# EAGLE design LaserGRBL_v2 (EAGLE 7.4.0)
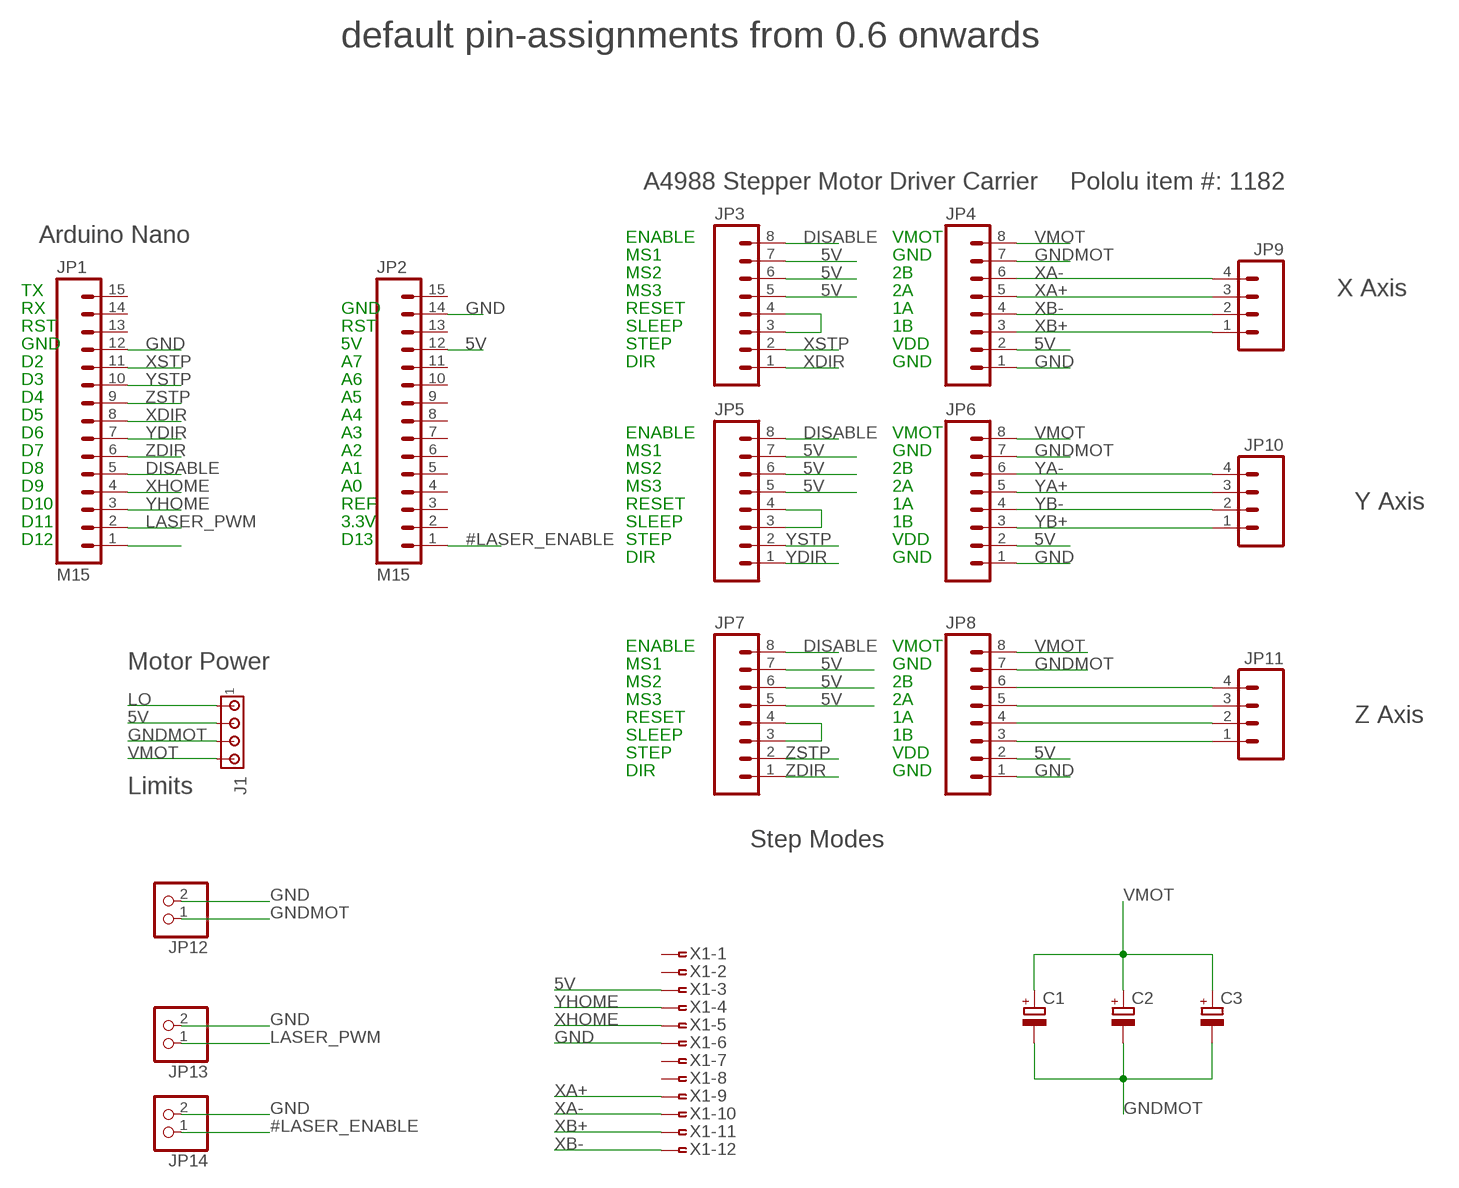
[diagram p0: schematic, sheet 1]

## Parts
C1  CPOL-EUE5-10.5  [E5-10,5]
C2  CPOL-EUE5-10.5  [E5-10,5]
C3  CPOL-EUE5-10.5  [E5-10,5]
J1  MTA04-156  [1X4MTA]
JP1  M15  [1X15]
JP2  M15  [1X15]
JP3  M08LONGPADS  [1X08_LONGPADS]
JP4  M08LONGPADS  [1X08_LONGPADS]
JP5  M08LONGPADS  [1X08_LONGPADS]
JP6  M08LONGPADS  [1X08_LONGPADS]
JP7  M08LONGPADS  [1X08_LONGPADS]
JP8  M08LONGPADS  [1X08_LONGPADS]
JP9  M04LONGPADS  [1X04_LONGPADS]
JP10  M04LONGPADS  [1X04_LONGPADS]
JP11  M04LONGPADS  [1X04_LONGPADS]
JP12  PINHD-1X2  [1X02]
JP13  PINHD-1X2  [1X02]
JP14  PINHD-1X2  [1X02]
X1  FSIDE-12  [FSIDE-12]

## Nets
5V: J1.2 JP2.12 JP3.5 JP3.6 JP3.7 JP4.2 JP5.5 JP5.6 JP5.7 JP6.2 JP7.5 JP7.6 JP7.7 JP8.2 X1.3
#LASER_ENABLE: JP2.1 JP14.1
DISABLE: JP1.5 JP3.8 JP5.8 JP7.8
GND: JP1.12 JP2.14 JP4.1 JP6.1 JP8.1 JP12.2 JP13.2 JP14.2 X1.6
GNDMOT: C1.- C2.- C3.- J1.3 JP4.7 JP6.7 JP8.7 JP12.1
LASER_PWM: JP1.2 JP13.1
LO: J1.1
N$1: JP5.3 JP5.4
N$6: JP8.6 JP11.4
N$7: JP8.5 JP11.3
N$8: JP8.4 JP11.2
N$9: JP8.3 JP11.1
N$14: JP7.3 JP7.4
N$15: JP3.3 JP3.4
N$16: JP1.1
VMOT: C1.+ C2.+ C3.+ J1.4 JP4.8 JP6.8 JP8.8
XA+: JP4.5 JP9.3 X1.9
XA-: JP4.6 JP9.4 X1.10
XB+: JP4.3 JP9.1 X1.11
XB-: JP4.4 JP9.2 X1.12
XDIR: JP1.8 JP3.1
XHOME: JP1.4 X1.5
XSTP: JP1.11 JP3.2
YA+: JP6.5 JP10.3
YA-: JP6.6 JP10.4
YB+: JP6.3 JP10.1
YB-: JP6.4 JP10.2
YDIR: JP1.7 JP5.1
YHOME: JP1.3 X1.4
YSTP: JP1.10 JP5.2
ZDIR: JP1.6 JP7.1
ZSTP: JP1.9 JP7.2
Unconnected: JP1.13 JP1.14 JP1.15 JP2.2 JP2.3 JP2.4 JP2.5 JP2.6 JP2.7 JP2.8 JP2.9 JP2.10 JP2.11 JP2.13 JP2.15 X1.1 X1.2 X1.7 X1.8

## Notes on the sheet
- default pin-assignments from 0.6 onwards
- A4988 Stepper Motor Driver Carrier | Pololu item #: 1182
- Arduino Nano | ENABLE | VMOT
- MS1 | GND
- MS2 | 2B
- TX | MS3 | 2A | X Axis
- RX | GND | RESET | 1A
- RST | RST | SLEEP | 1B
- GND | 5V | STEP | VDD
- D2 | A7 | DIR | GND
- D3 | A6
- D4 | A5
- D5 | A4
- D6 | A3 | ENABLE | VMOT
- D7 | A2 | MS1 | GND
- D8 | A1 | MS2 | 2B
- D9 | A0 | MS3 | 2A
- D10 | REF | RESET | 1A | Y Axis
- D11 | 3.3V | SLEEP | 1B
- D12 | D13 | STEP | VDD
- DIR | GND
- ENABLE | VMOT
- Motor Power | MS1 | GND
- MS2 | 2B
- MS3 | 2A
- RESET | 1A | Z Axis
- SLEEP | 1B
- STEP | VDD
- DIR | GND
- Limits
- Step Modes

## Library data of the parts
C1-C3 = rcl:CPOL-EU: POLARIZED CAPACITOR, European symbol
J1 = con-amp:MTA04-156: AMP connector
JP1 JP2 = SparkFun:M15: Header 15 Standard 15-pin 0.1" header. Use with straight break away headers (SKU : PRT-00116), right angle break away headers (PRT-00553), swiss pins (PRT-00743), machine pins (PRT-00117), and female headers (PRT-00115).
JP3-JP8 = SparkFun:M08: Header 8 Standard 8-pin 0.1" header. Use with straight break away headers (SKU : PRT-00116), right angle break away headers (PRT-00553), swiss pins (PRT-00743), machine pins (PRT-00117), and female headers (PRT-00115).
JP9-JP11 = SparkFun:M04: Header 4 Standard 4-pin 0.1" header. Use with straight break away headers (SKU : PRT-00116), right angle break away headers (PRT-00553), swiss pins (PRT-00743), machine pins (PRT-00117), and female headers (PRT-00115). Molex polarized connector foot print use with SKU : PRT-08231 with associated crimp pins and housings. 1MM SMD Version SKU: PRT-10208
JP12-JP14 = pinhead:PINHD-1X2: PIN HEADER
X1 = con-amp:FSIDE-12: AMP connector

## Board
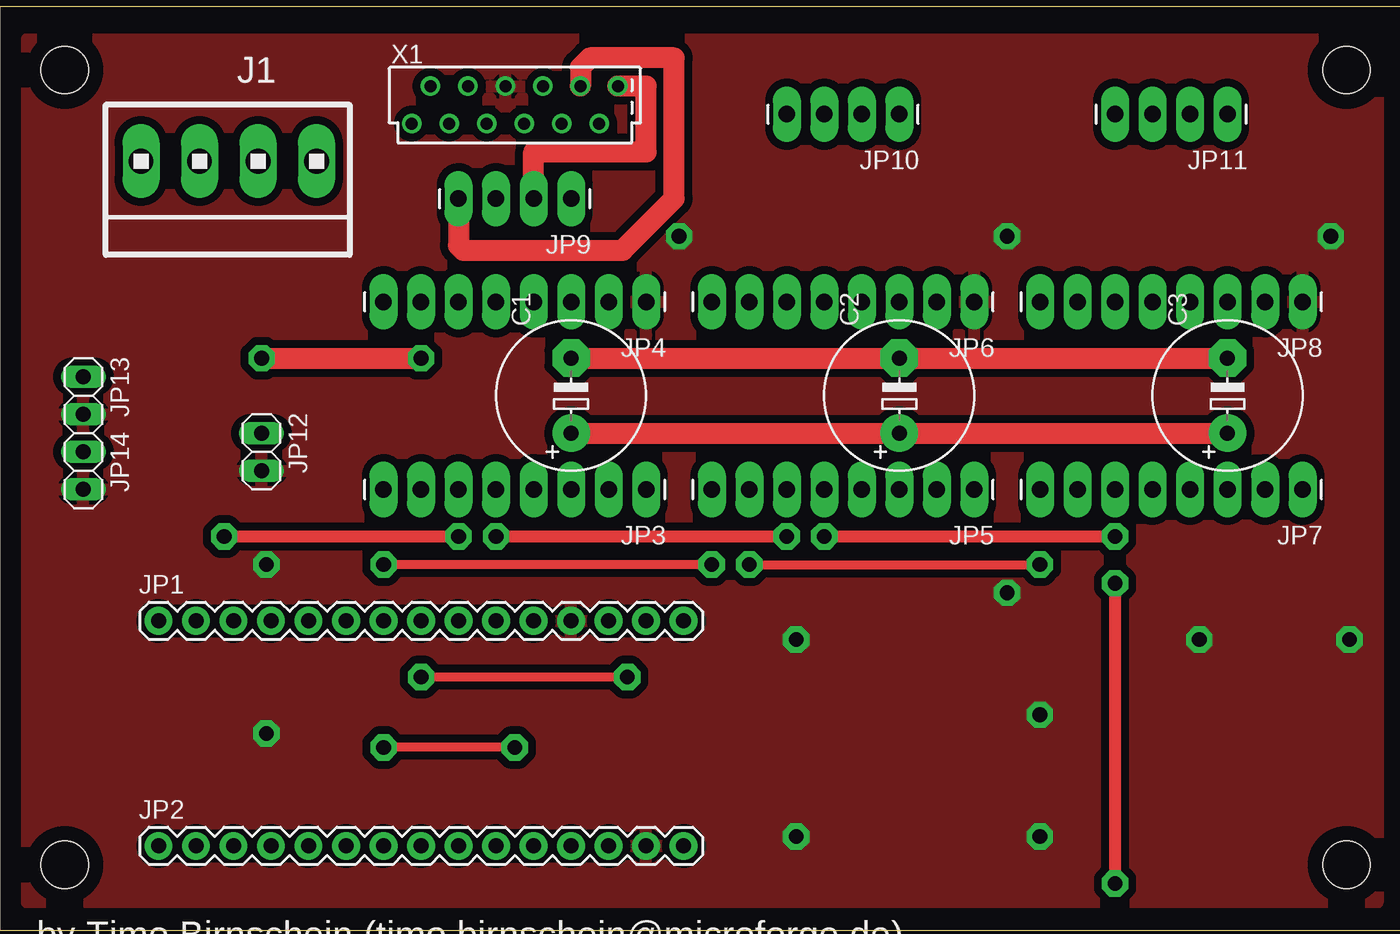
[diagram p1: board, top side]
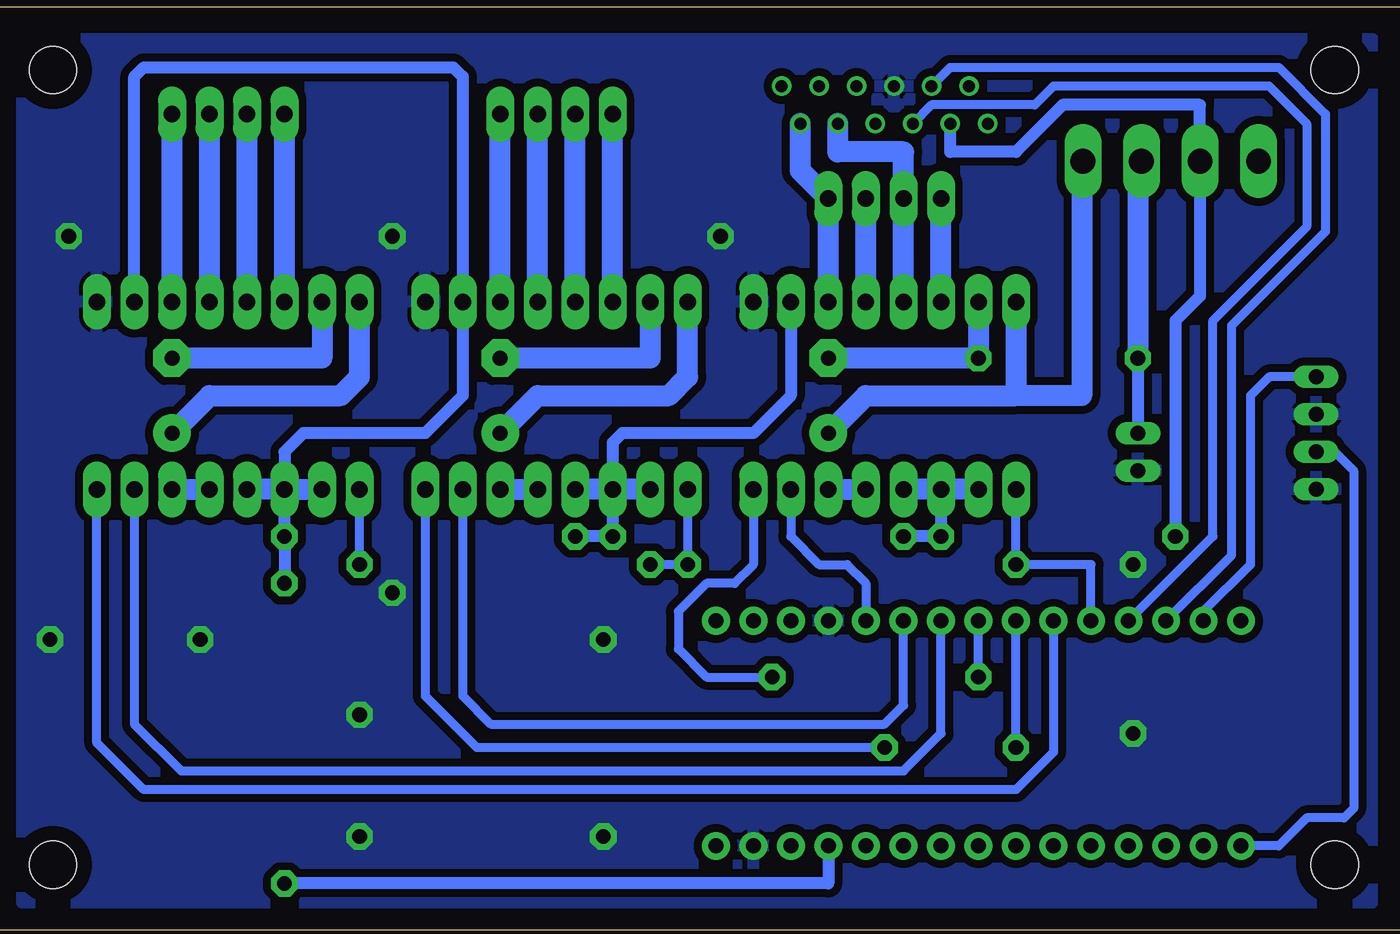
[diagram p2: board, bottom side, seen from below]

No outline drawn. Coordinates in mm, seen from the top.
Copper layers (1*16): Top 0.035mm / dielectric 1.5mm / Bottom 0.035mm
Design rules "default": minimum track width 25mil, minimum drill 28mil, track to track 10mil, track to pad 10mil, pad to pad 10mil, via to via 10mil, smd to smd 10mil, copper to edge 40mil, drill to drill 8mil, minimum pad ring 10mil, minimum via ring 8mil, stop-mask expansion 4mil, vias tented up to drill 0mil, thermal gap 10mil
Holes 3.2 mm at 2.54,56.34 89.34,56.34 89.34,2.54 2.54,2.54
Milling: 4 lines

### Footprints (pad centres in the part's own frame; a part is rotated, then mirrored left to right if it is on the bottom)
E5-10,5 = drill 1.016 pad 2.54: + -2.54,0 | drill 1.016 pad 2.54 octagon: - 2.54,0
1X4MTA = drill 1.676 long: 1 5.944,0; 2 1.981,0; 3 -1.981,0; 4 -5.944,0
1X15 = drill 1.016 pad 1.88: 1 0,0; 2 2.54,0; 3 5.08,0; 4 7.62,0; 5 10.16,0; 6 12.7,0; 7 15.24,0; 8 17.78,0; 9 20.32,0; 10 22.86,0; 11 25.4,0; 12 27.94,0; 13 30.48,0; 14 33.02,0; 15 35.56,0
1X08_LONGPADS = drill 1.118 pad 1.88 long: 1 0,0; 2 2.54,0; 3 5.08,0; 4 7.62,0; 5 10.16,0; 6 12.7,0; 7 15.24,0; 8 17.78,0
1X04_LONGPADS = drill 1.118 pad 1.88 long: 1 0,0; 2 2.54,0; 3 5.08,0; 4 7.62,0
1X02 = drill 1.016 long: 1 -1.27,0; 2 1.27,0
FSIDE-12 = drill 0.813: 1 -6.985,-1.27; 2 -5.715,1.27; 3 -4.445,-1.27; 4 -3.175,1.27; 5 -1.905,-1.27; 6 -0.635,1.27; 7 0.635,-1.27; 8 1.905,1.27; 9 3.175,-1.27; 10 4.445,1.27; 11 5.715,-1.27; 12 6.985,1.27

### Placement (x,y rotation side)
C1  36.83,34.29 90 top
C2  59.05,34.29 90 top
C3  81.28,34.29 90 top
J1  13.65,50.16 180 top
JP1  8.89,19.05 0 top
JP2  8.89,3.81 0 top
JP3  41.91,27.94 180 top
JP4  41.91,40.64 180 top
JP5  64.14,27.94 180 top
JP6  64.14,40.64 180 top
JP7  86.36,27.94 180 top
JP8  86.36,40.64 180 top
JP9  36.83,47.62 180 top
JP10  59.05,53.34 180 top
JP11  81.28,53.34 180 top
JP12  15.88,30.48 270 top
JP13  3.81,34.29 270 top
JP14  3.81,29.21 270 top
X1  33.02,53.98 0 top

### Tracks (layer width: path | path; a pad name or v marks a point on that pad's centre or on a via)
5V  (via drill 1 pad 1.78)
  Top 0.813: v13.34,24.77 v29.21,24.77 | v73.66,21.59 v73.66,1.27 | v53.98,24.77 v73.66,24.77 | v31.75,24.77 v51.44,24.77
  Bottom 0.813: X1.3 28.57,50.8 24.13,50.8 20.95,53.98 11.67,53.98 J1.2 11.67,41.03 13.34,39.37 v13.34,24.77 | JP3.6 v29.21,24.77 v31.75,24.77 | JP4.2 39.37,34.29 41.91,31.75 50.8,31.75 51.44,31.11 JP5.6 v51.44,24.77 v53.98,24.77 | JP8.2 83.82,55.88 83.19,56.52 62.23,56.52 61.59,55.88 JP6.2 61.59,34.29 64.14,31.75 72.39,31.75 73.66,30.48 JP7.6 v73.66,24.77 v73.66,21.59 | JP2.12 36.83,1.27 v73.66,1.27
  Bottom 1.422: JP3.7 JP3.6 JP3.5 | JP5.7 JP5.6 JP5.5 | JP7.7 JP7.6 JP7.5
#LASER_ENABLE
  Bottom 0.406: JP14.1 2.54,30.48
  Bottom 0.61: 2.54,30.48 1.27,29.21 1.27,6.35 1.91,5.71 4.45,5.71 6.35,3.81 JP2.1
DISABLE  (via drill 1 pad 1.78)
  Top 0.61: v46.35,22.86 v24.13,22.86 | v48.9,22.86 v68.58,22.86
  Bottom 0.61: JP1.5 19.05,22.86 v24.13,22.86 JP3.8 | JP5.8 v46.35,22.86 v48.9,22.86 | v68.58,22.86 JP7.8
GND  (via drill 1 pad 1.78)
  other vias: 66.36,45.09 66.36,20.95 68.58,12.7 68.58,4.45 79.38,17.78 89.53,17.78 88.27,45.09 52.07,17.78 52.07,4.45 44.13,45.09 16.19,11.43 16.19,22.86
  pour Bottom (isolate 0.533, rank 6): 0,58.42 91.44,58.42 91.44,0 0,0
  pour Top (isolate 0.533, rank 6): 0,58.42 91.44,58.42 91.44,0 0,0
GNDMOT  (via drill 1 pad 1.78)
  Top 1.422: v15.88,36.83 v26.67,36.83 | C1.- C2.- C3.-
  Bottom 0.813: v15.88,36.83 JP12.1
  Bottom 1.422: JP4.7 v26.67,36.83 C1.- | JP6.7 48.9,36.83 C2.- | JP8.7 71.12,36.83 C3.- | J1.3 15.88,49.92 v15.88,36.83
LASER_PWM
  Bottom 0.61: JP13.1 6.99,35.56 8.26,34.29 8.26,22.86 11.43,19.68 JP1.2
N$1
  Bottom 1.422: JP5.3 JP5.4
N$6
  Bottom 1.422: JP8.6 JP11.4
N$7
  Bottom 1.422: JP8.5 JP11.3
N$8
  Bottom 1.422: JP8.4 JP11.2
N$9
  Bottom 1.422: JP8.3 JP11.1
N$14
  Bottom 1.422: JP7.3 JP7.4
N$15
  Bottom 1.422: JP3.3 JP3.4
VMOT
  Top 1.422: C1.+ C2.+ C3.+
  Bottom 1.422: JP4.8 24.13,34.29 | J1.4 19.68,50.08 19.68,34.29 24.13,34.29 | C1.+ 34.29,34.29 24.13,34.29 | C3.+ 78.74,34.29 69.85,34.29 68.58,35.56 JP8.8 | C2.+ 56.52,34.29 47.62,34.29 46.35,35.56 JP6.8
XA+
  Bottom 1.422: JP4.5 JP9.3 31.75,50.8 36.2,50.8 X1.9
XA-
  Top 1.422: JP9.4 29.21,44.45 29.53,44.13 40.32,44.13 43.81,47.62 43.81,57.15 38.1,57.15 37.47,56.52 X1.10
  Bottom 1.422: JP4.6 JP9.4
XB+
  Bottom 1.422: JP4.3 JP9.1 38.73,49.53 X1.11
XB-
  Top 1.422: JP9.2 34.29,50.8 41.91,50.8 41.91,55.24 X1.12
  Bottom 1.422: JP4.4 JP9.2
XDIR  (via drill 1 pad 1.78)
  Top 0.61: v40.64,15.24 v26.67,15.24
  Bottom 0.61: JP3.1 41.91,22.86 43.18,21.59 45.09,21.59 46.99,19.68 46.99,17.14 45.09,15.24 v40.64,15.24 | v26.67,15.24 JP1.8
XHOME
  Bottom 0.61: JP1.4 10.79,24.77 10.79,39.37 4.45,45.72 4.45,52.7 6.99,55.24 21.59,55.24 22.86,53.98 29.84,53.98 X1.5
XSTP
  Bottom 0.61: JP3.2 39.37,24.77 37.47,22.86 35.56,22.86 34.29,21.59 JP1.11
YA+
  Bottom 1.422: JP6.5 JP10.3
YA-
  Bottom 1.422: JP6.6 JP10.4
YB+
  Bottom 1.422: JP6.3 JP10.1
YB-
  Bottom 1.422: JP6.4 JP10.2
YDIR  (via drill 1 pad 1.78)
  Top 0.61: v33.02,10.48 v24.13,10.48
  Bottom 0.61: JP5.1 64.14,13.97 60.64,10.48 v33.02,10.48 | v24.13,10.48 JP1.7
YHOME
  Bottom 0.61: X1.4 28.57,56.52 6.35,56.52 3.17,53.34 3.17,45.4 9.53,39.05 9.53,23.5 JP1.3
YSTP
  Bottom 0.61: JP5.2 61.59,13.97 59.69,12.06 33.02,12.06 31.75,13.34 JP1.10
ZDIR
  Bottom 0.61: JP1.6 21.59,10.16 24.13,7.62 83.19,7.62 86.36,10.79 JP7.1
ZSTP
  Bottom 0.61: JP7.2 83.82,12.06 80.64,8.89 31.75,8.89 29.21,11.43 JP1.9

### Text on the board
tNames: by Timo Birnschein (timo.birnschein@microforge.de) / Based on schematics by github.com/txjammer (seems offline)